# Altium schematic sheet 03.Main.SchDoc
size 566 x 398 mm; CheckedBy: YPC; DocumentNumber: 3; Revision: V1.00; SheetNumber: 03; SheetTotal: 18; SheetName: Main; SheetDescribe: Main; Designer: JOW; DesignDate: 2025-04-25; CheckedData: 2025-04-25; CheckDate: 2025-04-25
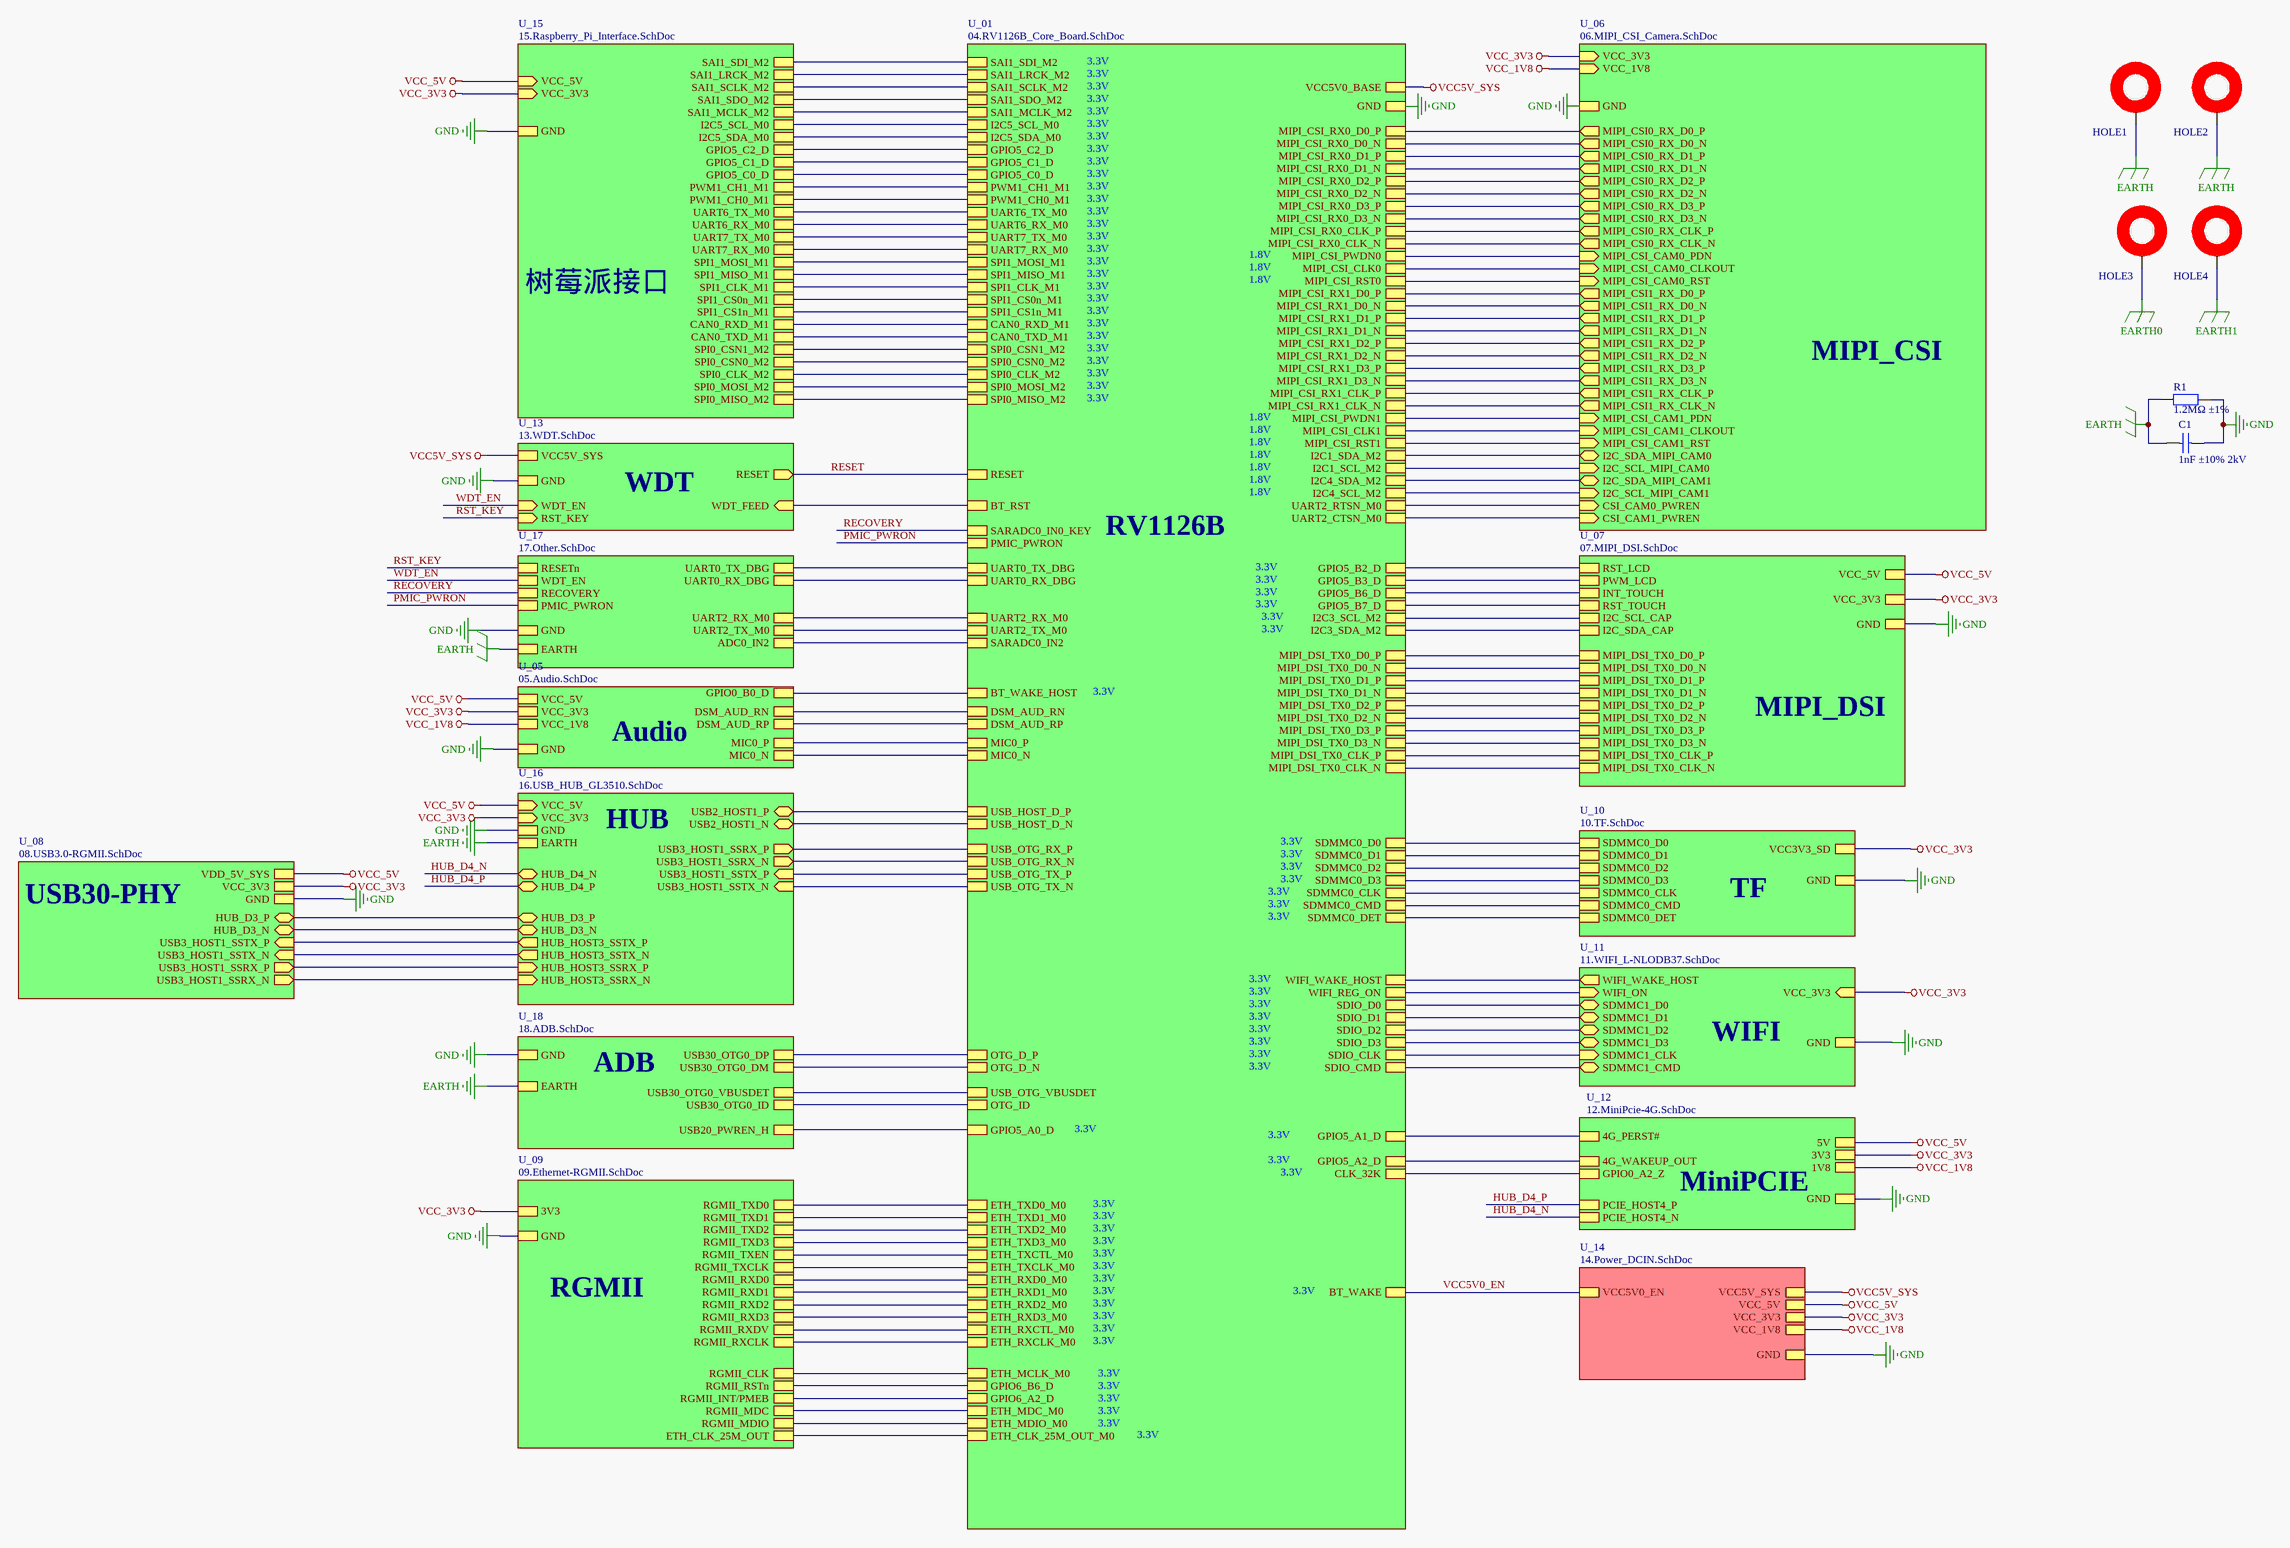
[diagram p0: 03.Main.SchDoc]

## Parts
C1  描述: 1nF ±10% 2kV  [1206_C]  (hidden comment: CC1206KKX7RDBB102)
HOLE1  HOLE1  [HOLE-3.2 - Screw]  (value not drawn)  (no BOM)
HOLE2  HOLE1  [HOLE-3.2 - Screw]  (value not drawn)  (no BOM)
HOLE3  HOLE1  [HOLE-3.2 - Screw]  (value not drawn)  (no BOM)
HOLE4  HOLE1  [HOLE-3.2 - Screw]  (value not drawn)  (no BOM)
R1  描述: 1.2MΩ ±1%  [1206_R]  (hidden comment: 1206W4F1204T5E)

## Sub-sheets
U_01 = 04.RV1126B_Core_Board.SchDoc: VCC5V0_BASE, GND, MIPI_CSI_RX1_D0_P, MIPI_CSI_RX1_D0_N, MIPI_CSI_RX1_D1_P, MIPI_CSI_RX1_D1_N, MIPI_CSI_RX1_D2_P, MIPI_CSI_RX1_D2_N, MIPI_CSI_RX1_D3_P, MIPI_CSI_RX1_D3_N, MIPI_CSI_RX1_CLK_P, MIPI_CSI_RX1_CLK_N, MIPI_CSI_PWDN1, MIPI_CSI_CLK1, MIPI_CSI_RST1, MIPI_CSI_RX0_D0_P, MIPI_CSI_RX0_D0_N, MIPI_CSI_RX0_D1_P, MIPI_CSI_RX0_D1_N, MIPI_CSI_RX0_D2_P, MIPI_CSI_RX0_D2_N, MIPI_CSI_RX0_D3_P, MIPI_CSI_RX0_D3_N, MIPI_CSI_RX0_CLK_P, MIPI_CSI_RX0_CLK_N, MIPI_CSI_PWDN0, MIPI_CSI_CLK0, MIPI_CSI_RST0, OTG_ID, OTG_D_N, OTG_D_P, USB_HOST_D_N, USB_HOST_D_P, MIPI_DSI_TX0_D0_P, MIPI_DSI_TX0_D0_N, MIPI_DSI_TX0_D1_P, MIPI_DSI_TX0_D1_N, MIPI_DSI_TX0_D2_P, MIPI_DSI_TX0_D2_N, MIPI_DSI_TX0_D3_P, MIPI_DSI_TX0_D3_N, MIPI_DSI_TX0_CLK_P, MIPI_DSI_TX0_CLK_N, SDMMC0_CMD, SDMMC0_D0, SDMMC0_D1, SDMMC0_D2, SDMMC0_D3, SDMMC0_CLK, CLK_32K, BT_WAKE, SDIO_CLK, SDIO_D0, SDIO_D1, SDIO_D2, SDIO_D3, SDIO_CMD, RESET, SDMMC0_DET, WIFI_REG_ON, BT_RST, WIFI_WAKE_HOST, SPI0_MOSI_M2, SPI0_CLK_M2, UART7_TX_M0, SPI0_CSN0_M2, UART6_RX_M0, UART6_TX_M0, GPIO5_B3_D, GPIO5_B2_D, GPIO5_A1_D, GPIO5_A0_D, SPI0_CSN1_M2, GPIO5_A2_D, DSM_AUD_RP, MIC0_P, MIC0_N, USB_OTG_VBUSDET, GPIO5_C2_D, SPI0_MISO_M2, I2C3_SCL_M2, I2C3_SDA_M2, PWM1_CH1_M1, PWM1_CH0_M1, SAI1_SDI_M2, SAI1_LRCK_M2, SAI1_SCLK_M2, SAI1_SDO_M2, SAI1_MCLK_M2, GPIO5_C1_D, GPIO5_C0_D, UART7_RX_M0, GPIO5_B6_D, GPIO5_B7_D, ETH_RXCLK_M0, ETH_MCLK_M0, ETH_TXCTL_M0, ETH_RXD0_M0, ETH_TXD1_M0, ETH_TXD0_M0, ETH_TXD3_M0, ETH_RXD2_M0, ETH_TXD2_M0, ETH_RXD1_M0, ETH_RXD3_M0, GPIO6_A2_D, CAN0_TXD_M1, ETH_RXCTL_M0, GPIO6_B6_D, ETH_MDIO_M0, ETH_CLK_25M_OUT_M0, ETH_MDC_M0, ETH_TXCLK_M0, CAN0_RXD_M1, UART0_RX_DBG, UART0_TX_DBG, UART2_RX_M0, UART2_TX_M0, UART2_RTSN_M0, UART2_CTSN_M0, SARADC0_IN2, SARADC0_IN0_KEY, PMIC_PWRON, USB_OTG_TX_P, USB_OTG_TX_N, USB_OTG_RX_P, USB_OTG_RX_N, I2C1_SDA_M2, I2C1_SCL_M2, I2C5_SDA_M0, I2C4_SDA_M2, I2C4_SCL_M2, I2C5_SCL_M0, SPI1_MOSI_M1, SPI1_MISO_M1, SPI1_CS1n_M1, SPI1_CLK_M1, SPI1_CS0n_M1, DSM_AUD_RN, BT_WAKE_HOST
U_05 = 05.Audio.SchDoc: GND, DSM_AUD_RN, DSM_AUD_RP, MIC0_P, MIC0_N, VCC_1V8, VCC_5V, GPIO0_B0_D, VCC_3V3
U_06 = 06.MIPI_CSI_Camera.SchDoc: MIPI_CSI1_RX_CLK_N (out), MIPI_CSI1_RX_CLK_P (out), MIPI_CSI1_RX_D0_N (out), MIPI_CSI1_RX_D0_P (out), MIPI_CSI1_RX_D1_N (out), MIPI_CSI1_RX_D1_P (out), MIPI_CSI1_RX_D2_N (out), MIPI_CSI1_RX_D2_P (out), MIPI_CSI1_RX_D3_N (out), MIPI_CSI1_RX_D3_P (out), MIPI_CSI0_RX_D2_N (out), MIPI_CSI0_RX_D3_N (out), MIPI_CSI0_RX_D2_P (out), MIPI_CSI0_RX_D3_P (out), MIPI_CSI0_RX_D1_N (out), MIPI_CSI0_RX_D1_P (out), MIPI_CSI0_RX_CLK_N (out), MIPI_CSI0_RX_CLK_P (out), MIPI_CSI0_RX_D0_N (out), MIPI_CSI0_RX_D0_P (out), I2C_SDA_MIPI_CAM0 (bidir), I2C_SCL_MIPI_CAM0 (in), I2C_SDA_MIPI_CAM1 (bidir), I2C_SCL_MIPI_CAM1 (in), GND, VCC_3V3 (in), VCC_1V8 (in), MIPI_CSI_CAM0_RST (in), MIPI_CSI_CAM0_PDN (in), MIPI_CSI_CAM0_CLKOUT (in), MIPI_CSI_CAM1_RST (in), MIPI_CSI_CAM1_PDN (in), MIPI_CSI_CAM1_CLKOUT (in), CSI_CAM1_PWREN (in), CSI_CAM0_PWREN (in)
U_07 = 07.MIPI_DSI.SchDoc: GND, RST_LCD, PWM_LCD, I2C_SDA_CAP, I2C_SCL_CAP, INT_TOUCH, RST_TOUCH, VCC_3V3, MIPI_DSI_TX0_D0_P, MIPI_DSI_TX0_D0_N, MIPI_DSI_TX0_D1_P, MIPI_DSI_TX0_D1_N, MIPI_DSI_TX0_D2_P, MIPI_DSI_TX0_D2_N, MIPI_DSI_TX0_D3_P, MIPI_DSI_TX0_D3_N, MIPI_DSI_TX0_CLK_P, MIPI_DSI_TX0_CLK_N, VCC_5V
U_08 = 08.USB3.0-RGMII.SchDoc: USB3_HOST1_SSRX_N (out), USB3_HOST1_SSTX_P (in), USB3_HOST1_SSTX_N (in), GND, VDD_5V_SYS, HUB_D3_N (bidir), USB3_HOST1_SSRX_P (out), HUB_D3_P (bidir), VCC_3V3
U_09 = 09.Ethernet-RGMII.SchDoc: GND, 3V3, RGMII_TXD0, RGMII_TXD1, RGMII_TXD2, RGMII_TXD3, RGMII_TXEN, RGMII_TXCLK, RGMII_RXD0, RGMII_RXD1, RGMII_RXD2, RGMII_RXD3, RGMII_RXDV, RGMII_RXCLK, ETH_CLK_25M_OUT, RGMII_CLK, RGMII_MDC, RGMII_MDIO, RGMII_RSTn, RGMII_INT/PMEB
U_10 = 10.TF.SchDoc: SDMMC0_D0, SDMMC0_D1, SDMMC0_D2, SDMMC0_D3, SDMMC0_CLK, SDMMC0_CMD, SDMMC0_DET, VCC3V3_SD, GND
U_11 = 11.WIFI_L-NLODB37.SchDoc: GND, VCC_3V3 (in), SDMMC1_D3 (bidir), SDMMC1_D2 (bidir), SDMMC1_D1 (bidir), SDMMC1_D0 (bidir), SDMMC1_CMD (bidir), SDMMC1_CLK (in), WIFI_ON (in), WIFI_WAKE_HOST (out)
U_12 = 12.MiniPcie-4G.SchDoc: GND, 5V, 3V3, 4G_PERST#, 4G_WAKEUP_OUT, 1V8, PCIE_HOST4_P, PCIE_HOST4_N, GPIO0_A2_Z
U_13 = 13.WDT.SchDoc: WDT_FEED (in), WDT_EN (in), RESET (out), RST_KEY (in), GND, VCC5V_SYS
U_14 = 14.Power_DCIN.SchDoc: GND, VCC_3V3, VCC_1V8, VCC_5V, VCC5V0_EN, VCC5V_SYS
U_15 = 15.Raspberry_Pi_Interface.SchDoc: VCC_5V (in), VCC_3V3 (in), GND, SAI1_SDI_M2, SAI1_LRCK_M2, SAI1_SCLK_M2, SAI1_SDO_M2, SAI1_MCLK_M2, SPI1_CS1n_M1, SPI1_CS0n_M1, SPI1_CLK_M1, SPI1_MISO_M1, SPI1_MOSI_M1, PWM1_CH1_M1, PWM1_CH0_M1, GPIO5_C2_D, GPIO5_C1_D, GPIO5_C0_D, SPI0_CSN1_M2, SPI0_CSN0_M2, SPI0_CLK_M2, SPI0_MOSI_M2, I2C5_SCL_M0, I2C5_SDA_M0, SPI0_MISO_M2, UART6_TX_M0, UART6_RX_M0, UART7_TX_M0, UART7_RX_M0, CAN0_RXD_M1, CAN0_TXD_M1
U_16 = 16.USB_HUB_GL3510.SchDoc: GND, VCC_5V (in), VCC_3V3 (in), USB2_HOST1_P (bidir), USB2_HOST1_N (bidir), USB3_HOST1_SSRX_P (out), USB3_HOST1_SSRX_N (out), USB3_HOST1_SSTX_P (in), USB3_HOST1_SSTX_N (in), EARTH, HUB_D4_P (bidir), HUB_D4_N (bidir), HUB_HOST3_SSRX_N (in), HUB_HOST3_SSRX_P (in), HUB_D3_N (bidir), HUB_HOST3_SSTX_N (out), HUB_HOST3_SSTX_P (out), HUB_D3_P (bidir)
U_17 = 17.Other.SchDoc: RESETn, PMIC_PWRON, RECOVERY, UART0_RX_DBG, UART0_TX_DBG, WDT_EN, UART2_RX_M0, UART2_TX_M0, ADC0_IN2, GND, EARTH
U_18 = 18.ADB.SchDoc: GND, EARTH, USB30_OTG0_VBUSDET, USB30_OTG0_DP, USB30_OTG0_DM, USB30_OTG0_ID, USB20_PWREN_H

## Nets
EARTH: C1.1 HOLE1.1 HOLE2.1 R1.1 ; sheet U_17/EARTH, sheet U_16/EARTH, sheet U_18/EARTH
EARTH0: HOLE3.1
EARTH1: HOLE4.1
GND: C1.2 R1.2 ; sheet U_01/GND, sheet U_14/GND, sheet U_13/GND, sheet U_17/GND, sheet U_05/GND, sheet U_06/GND, sheet U_07/GND, sheet U_10/GND, sheet U_11/GND, sheet U_09/GND, sheet U_15/GND, sheet U_08/GND, sheet U_16/GND, sheet U_18/GND, sheet U_12/GND
VCC5V_SYS: sheet U_01/VCC5V0_BASE, sheet U_14/VCC5V_SYS, sheet U_13/VCC5V_SYS
VCC_1V8: sheet U_14/VCC_1V8, sheet U_05/VCC_1V8, sheet U_06/VCC_1V8, sheet U_12/1V8
VCC_3V3: sheet U_14/VCC_3V3, sheet U_05/VCC_3V3, sheet U_06/VCC_3V3, sheet U_07/VCC_3V3, sheet U_10/VCC3V3_SD, sheet U_11/VCC_3V3, sheet U_09/3V3, sheet U_15/VCC_3V3, sheet U_08/VCC_3V3, sheet U_16/VCC_3V3, sheet U_12/3V3
VCC_5V: sheet U_14/VCC_5V, sheet U_05/VCC_5V, sheet U_07/VCC_5V, sheet U_15/VCC_5V, sheet U_08/VDD_5V_SYS, sheet U_16/VCC_5V, sheet U_12/5V
HUB_D4_N: sheet U_16/HUB_D4_N, sheet U_12/PCIE_HOST4_N
HUB_D4_P: sheet U_16/HUB_D4_P, sheet U_12/PCIE_HOST4_P
PMIC_PWRON: sheet U_01/PMIC_PWRON, sheet U_17/PMIC_PWRON
RECOVERY: sheet U_01/SARADC0_IN0_KEY, sheet U_17/RECOVERY
RESET: sheet U_01/RESET, sheet U_13/RESET
RST_KEY: sheet U_13/RST_KEY, sheet U_17/RESETn
VCC5V0_EN: sheet U_01/BT_WAKE, sheet U_14/VCC5V0_EN
WDT_EN: sheet U_13/WDT_EN, sheet U_17/WDT_EN
(unnamed): sheet U_01/MIPI_CSI_RX1_D0_P, sheet U_06/MIPI_CSI1_RX_D0_P
(unnamed): sheet U_01/MIPI_CSI_RX1_D0_N, sheet U_06/MIPI_CSI1_RX_D0_N
(unnamed): sheet U_01/MIPI_CSI_RX1_D1_P, sheet U_06/MIPI_CSI1_RX_D1_P
(unnamed): sheet U_01/MIPI_CSI_RX1_D1_N, sheet U_06/MIPI_CSI1_RX_D1_N
(unnamed): sheet U_01/MIPI_CSI_RX1_D2_P, sheet U_06/MIPI_CSI1_RX_D2_P
(unnamed): sheet U_01/MIPI_CSI_RX1_D2_N, sheet U_06/MIPI_CSI1_RX_D2_N
(unnamed): sheet U_01/MIPI_CSI_RX1_D3_P, sheet U_06/MIPI_CSI1_RX_D3_P
(unnamed): sheet U_01/MIPI_CSI_RX1_D3_N, sheet U_06/MIPI_CSI1_RX_D3_N
(unnamed): sheet U_01/MIPI_CSI_RX1_CLK_P, sheet U_06/MIPI_CSI1_RX_CLK_P
(unnamed): sheet U_01/MIPI_CSI_RX1_CLK_N, sheet U_06/MIPI_CSI1_RX_CLK_N
(unnamed): sheet U_01/MIPI_CSI_PWDN1, sheet U_06/MIPI_CSI_CAM1_PDN
(unnamed): sheet U_01/MIPI_CSI_CLK1, sheet U_06/MIPI_CSI_CAM1_CLKOUT
(unnamed): sheet U_01/MIPI_CSI_RST1, sheet U_06/MIPI_CSI_CAM1_RST
(unnamed): sheet U_01/MIPI_CSI_RX0_D0_P, sheet U_06/MIPI_CSI0_RX_D0_P
(unnamed): sheet U_01/MIPI_CSI_RX0_D0_N, sheet U_06/MIPI_CSI0_RX_D0_N
(unnamed): sheet U_01/MIPI_CSI_RX0_D1_P, sheet U_06/MIPI_CSI0_RX_D1_P
(unnamed): sheet U_01/MIPI_CSI_RX0_D1_N, sheet U_06/MIPI_CSI0_RX_D1_N
(unnamed): sheet U_01/MIPI_CSI_RX0_D2_P, sheet U_06/MIPI_CSI0_RX_D2_P
(unnamed): sheet U_01/MIPI_CSI_RX0_D2_N, sheet U_06/MIPI_CSI0_RX_D2_N
(unnamed): sheet U_01/MIPI_CSI_RX0_D3_P, sheet U_06/MIPI_CSI0_RX_D3_P
(unnamed): sheet U_01/MIPI_CSI_RX0_D3_N, sheet U_06/MIPI_CSI0_RX_D3_N
(unnamed): sheet U_01/MIPI_CSI_RX0_CLK_P, sheet U_06/MIPI_CSI0_RX_CLK_P
(unnamed): sheet U_01/MIPI_CSI_RX0_CLK_N, sheet U_06/MIPI_CSI0_RX_CLK_N
(unnamed): sheet U_01/MIPI_CSI_PWDN0, sheet U_06/MIPI_CSI_CAM0_PDN
(unnamed): sheet U_01/MIPI_CSI_CLK0, sheet U_06/MIPI_CSI_CAM0_CLKOUT
(unnamed): sheet U_01/MIPI_CSI_RST0, sheet U_06/MIPI_CSI_CAM0_RST
(unnamed): sheet U_01/OTG_ID, sheet U_18/USB30_OTG0_ID
(unnamed): sheet U_01/OTG_D_N, sheet U_18/USB30_OTG0_DM
(unnamed): sheet U_01/OTG_D_P, sheet U_18/USB30_OTG0_DP
(unnamed): sheet U_01/USB_HOST_D_N, sheet U_16/USB2_HOST1_N
(unnamed): sheet U_01/USB_HOST_D_P, sheet U_16/USB2_HOST1_P
(unnamed): sheet U_01/MIPI_DSI_TX0_D0_P, sheet U_07/MIPI_DSI_TX0_D0_P
(unnamed): sheet U_01/MIPI_DSI_TX0_D0_N, sheet U_07/MIPI_DSI_TX0_D0_N
(unnamed): sheet U_01/MIPI_DSI_TX0_D1_P, sheet U_07/MIPI_DSI_TX0_D1_P
(unnamed): sheet U_01/MIPI_DSI_TX0_D1_N, sheet U_07/MIPI_DSI_TX0_D1_N
(unnamed): sheet U_01/MIPI_DSI_TX0_D2_P, sheet U_07/MIPI_DSI_TX0_D2_P
(unnamed): sheet U_01/MIPI_DSI_TX0_D2_N, sheet U_07/MIPI_DSI_TX0_D2_N
(unnamed): sheet U_01/MIPI_DSI_TX0_D3_P, sheet U_07/MIPI_DSI_TX0_D3_P
(unnamed): sheet U_01/MIPI_DSI_TX0_D3_N, sheet U_07/MIPI_DSI_TX0_D3_N
(unnamed): sheet U_01/MIPI_DSI_TX0_CLK_P, sheet U_07/MIPI_DSI_TX0_CLK_P
(unnamed): sheet U_01/MIPI_DSI_TX0_CLK_N, sheet U_07/MIPI_DSI_TX0_CLK_N
(unnamed): sheet U_01/SDMMC0_CMD, sheet U_10/SDMMC0_CMD
(unnamed): sheet U_01/SDMMC0_D0, sheet U_10/SDMMC0_D0
(unnamed): sheet U_01/SDMMC0_D1, sheet U_10/SDMMC0_D1
(unnamed): sheet U_01/SDMMC0_D2, sheet U_10/SDMMC0_D2
(unnamed): sheet U_01/SDMMC0_D3, sheet U_10/SDMMC0_D3
(unnamed): sheet U_01/SDMMC0_CLK, sheet U_10/SDMMC0_CLK
(unnamed): sheet U_01/CLK_32K, sheet U_12/GPIO0_A2_Z
(unnamed): sheet U_01/SDIO_CLK, sheet U_11/SDMMC1_CLK
(unnamed): sheet U_01/SDIO_D0, sheet U_11/SDMMC1_D0
(unnamed): sheet U_01/SDIO_D1, sheet U_11/SDMMC1_D1
(unnamed): sheet U_01/SDIO_D2, sheet U_11/SDMMC1_D2
(unnamed): sheet U_01/SDIO_D3, sheet U_11/SDMMC1_D3
(unnamed): sheet U_01/SDIO_CMD, sheet U_11/SDMMC1_CMD
(unnamed): sheet U_01/SDMMC0_DET, sheet U_10/SDMMC0_DET
(unnamed): sheet U_01/WIFI_REG_ON, sheet U_11/WIFI_ON
(unnamed): sheet U_01/BT_RST, sheet U_13/WDT_FEED
(unnamed): sheet U_01/WIFI_WAKE_HOST, sheet U_11/WIFI_WAKE_HOST
(unnamed): sheet U_01/SPI0_MOSI_M2, sheet U_15/SPI0_MOSI_M2
(unnamed): sheet U_01/SPI0_CLK_M2, sheet U_15/SPI0_CLK_M2
(unnamed): sheet U_01/UART7_TX_M0, sheet U_15/UART7_TX_M0
(unnamed): sheet U_01/SPI0_CSN0_M2, sheet U_15/SPI0_CSN0_M2
(unnamed): sheet U_01/UART6_RX_M0, sheet U_15/UART6_RX_M0
(unnamed): sheet U_01/UART6_TX_M0, sheet U_15/UART6_TX_M0
(unnamed): sheet U_01/GPIO5_B3_D, sheet U_07/PWM_LCD
(unnamed): sheet U_01/GPIO5_B2_D, sheet U_07/RST_LCD
(unnamed): sheet U_01/GPIO5_A1_D, sheet U_12/4G_PERST#
(unnamed): sheet U_01/GPIO5_A0_D, sheet U_18/USB20_PWREN_H
(unnamed): sheet U_01/SPI0_CSN1_M2, sheet U_15/SPI0_CSN1_M2
(unnamed): sheet U_01/GPIO5_A2_D, sheet U_12/4G_WAKEUP_OUT
(unnamed): sheet U_01/DSM_AUD_RP, sheet U_05/DSM_AUD_RP
(unnamed): sheet U_01/MIC0_P, sheet U_05/MIC0_P
(unnamed): sheet U_01/MIC0_N, sheet U_05/MIC0_N
(unnamed): sheet U_01/USB_OTG_VBUSDET, sheet U_18/USB30_OTG0_VBUSDET
(unnamed): sheet U_01/GPIO5_C2_D, sheet U_15/GPIO5_C2_D
(unnamed): sheet U_01/SPI0_MISO_M2, sheet U_15/SPI0_MISO_M2
(unnamed): sheet U_01/I2C3_SCL_M2, sheet U_07/I2C_SCL_CAP
(unnamed): sheet U_01/I2C3_SDA_M2, sheet U_07/I2C_SDA_CAP
(unnamed): sheet U_01/PWM1_CH1_M1, sheet U_15/PWM1_CH1_M1
(unnamed): sheet U_01/PWM1_CH0_M1, sheet U_15/PWM1_CH0_M1
(unnamed): sheet U_01/SAI1_SDI_M2, sheet U_15/SAI1_SDI_M2
(unnamed): sheet U_01/SAI1_LRCK_M2, sheet U_15/SAI1_LRCK_M2
(unnamed): sheet U_01/SAI1_SCLK_M2, sheet U_15/SAI1_SCLK_M2
(unnamed): sheet U_01/SAI1_SDO_M2, sheet U_15/SAI1_SDO_M2
(unnamed): sheet U_01/SAI1_MCLK_M2, sheet U_15/SAI1_MCLK_M2
(unnamed): sheet U_01/GPIO5_C1_D, sheet U_15/GPIO5_C1_D
(unnamed): sheet U_01/GPIO5_C0_D, sheet U_15/GPIO5_C0_D
(unnamed): sheet U_01/UART7_RX_M0, sheet U_15/UART7_RX_M0
(unnamed): sheet U_01/GPIO5_B6_D, sheet U_07/INT_TOUCH
(unnamed): sheet U_01/GPIO5_B7_D, sheet U_07/RST_TOUCH
(unnamed): sheet U_01/ETH_RXCLK_M0, sheet U_09/RGMII_RXCLK
(unnamed): sheet U_01/ETH_MCLK_M0, sheet U_09/RGMII_CLK
(unnamed): sheet U_01/ETH_TXCTL_M0, sheet U_09/RGMII_TXEN
(unnamed): sheet U_01/ETH_RXD0_M0, sheet U_09/RGMII_RXD0
(unnamed): sheet U_01/ETH_TXD1_M0, sheet U_09/RGMII_TXD1
(unnamed): sheet U_01/ETH_TXD0_M0, sheet U_09/RGMII_TXD0
(unnamed): sheet U_01/ETH_TXD3_M0, sheet U_09/RGMII_TXD3
(unnamed): sheet U_01/ETH_RXD2_M0, sheet U_09/RGMII_RXD2
(unnamed): sheet U_01/ETH_TXD2_M0, sheet U_09/RGMII_TXD2
(unnamed): sheet U_01/ETH_RXD1_M0, sheet U_09/RGMII_RXD1
(unnamed): sheet U_01/ETH_RXD3_M0, sheet U_09/RGMII_RXD3
(unnamed): sheet U_01/GPIO6_A2_D, sheet U_09/RGMII_INT/PMEB
(unnamed): sheet U_01/CAN0_TXD_M1, sheet U_15/CAN0_TXD_M1
(unnamed): sheet U_01/ETH_RXCTL_M0, sheet U_09/RGMII_RXDV
(unnamed): sheet U_01/GPIO6_B6_D, sheet U_09/RGMII_RSTn
(unnamed): sheet U_01/ETH_MDIO_M0, sheet U_09/RGMII_MDIO
(unnamed): sheet U_01/ETH_CLK_25M_OUT_M0, sheet U_09/ETH_CLK_25M_OUT
(unnamed): sheet U_01/ETH_MDC_M0, sheet U_09/RGMII_MDC
(unnamed): sheet U_01/ETH_TXCLK_M0, sheet U_09/RGMII_TXCLK
(unnamed): sheet U_01/CAN0_RXD_M1, sheet U_15/CAN0_RXD_M1
(unnamed): sheet U_01/UART0_RX_DBG, sheet U_17/UART0_RX_DBG
(unnamed): sheet U_01/UART0_TX_DBG, sheet U_17/UART0_TX_DBG
(unnamed): sheet U_01/UART2_RX_M0, sheet U_17/UART2_RX_M0
(unnamed): sheet U_01/UART2_TX_M0, sheet U_17/UART2_TX_M0
(unnamed): sheet U_01/UART2_RTSN_M0, sheet U_06/CSI_CAM0_PWREN
(unnamed): sheet U_01/UART2_CTSN_M0, sheet U_06/CSI_CAM1_PWREN
(unnamed): sheet U_01/SARADC0_IN2, sheet U_17/ADC0_IN2
(unnamed): sheet U_01/USB_OTG_TX_P, sheet U_16/USB3_HOST1_SSTX_P
(unnamed): sheet U_01/USB_OTG_TX_N, sheet U_16/USB3_HOST1_SSTX_N
(unnamed): sheet U_01/USB_OTG_RX_P, sheet U_16/USB3_HOST1_SSRX_P
(unnamed): sheet U_01/USB_OTG_RX_N, sheet U_16/USB3_HOST1_SSRX_N
(unnamed): sheet U_01/I2C1_SDA_M2, sheet U_06/I2C_SDA_MIPI_CAM0
(unnamed): sheet U_01/I2C1_SCL_M2, sheet U_06/I2C_SCL_MIPI_CAM0
(unnamed): sheet U_01/I2C5_SDA_M0, sheet U_15/I2C5_SDA_M0
(unnamed): sheet U_01/I2C4_SDA_M2, sheet U_06/I2C_SDA_MIPI_CAM1
(unnamed): sheet U_01/I2C4_SCL_M2, sheet U_06/I2C_SCL_MIPI_CAM1
(unnamed): sheet U_01/I2C5_SCL_M0, sheet U_15/I2C5_SCL_M0
(unnamed): sheet U_01/SPI1_MOSI_M1, sheet U_15/SPI1_MOSI_M1
(unnamed): sheet U_01/SPI1_MISO_M1, sheet U_15/SPI1_MISO_M1
(unnamed): sheet U_01/SPI1_CS1n_M1, sheet U_15/SPI1_CS1n_M1
(unnamed): sheet U_01/SPI1_CLK_M1, sheet U_15/SPI1_CLK_M1
(unnamed): sheet U_01/SPI1_CS0n_M1, sheet U_15/SPI1_CS0n_M1
(unnamed): sheet U_01/DSM_AUD_RN, sheet U_05/DSM_AUD_RN
(unnamed): sheet U_01/BT_WAKE_HOST, sheet U_05/GPIO0_B0_D
(unnamed): sheet U_08/USB3_HOST1_SSRX_N, sheet U_16/HUB_HOST3_SSRX_N
(unnamed): sheet U_08/USB3_HOST1_SSTX_P, sheet U_16/HUB_HOST3_SSTX_P
(unnamed): sheet U_08/USB3_HOST1_SSTX_N, sheet U_16/HUB_HOST3_SSTX_N
(unnamed): sheet U_08/HUB_D3_N, sheet U_16/HUB_D3_N
(unnamed): sheet U_08/USB3_HOST1_SSRX_P, sheet U_16/HUB_HOST3_SSRX_P
(unnamed): sheet U_08/HUB_D3_P, sheet U_16/HUB_D3_P

## Notes on the sheet
- 3.3V
- 树莓派接口
- 1.8V
- MIPI_CSI
- WDT
- RV1126B
- MIPI_DSI
- Audio
- HUB
- USB30-PHY
- TF
- WIFI
- ADB
- MiniPCIE
- RGMII
- 产品名称
- 产品型号
- 设计人员
- 设计日期
- 审核人员
- 审核日期
- 图纸描述
- 图纸名称
- 图纸版本
- A2
- 广州灵眸科技有限公司

## Library data of the parts
C1 = 1206 1nF ±10% 2kV: SPZL000332; 名称: 贴片电容; 厂商: YAGEO(国巨); 封装: 1206; 工作温度: -55~125℃; 贴片和直插: SMD; 型号: CC1206KKX7RDBB102; SuppliersPartNumber: C23631; 商品编号: SPZL000332
R1 = 1206 1.2MΩ ±1%: SPZL000388; 封装: 1206; 厂商: UNI-ROYAL(厚声); 名称: 电阻; 贴片和直插: SMD; 工作温度: -55~155℃; SuppliersPartNumber: C22107; 型号: 1206W4F1204T5E; 商品编号: SPZL000388